# Altium project Reflow Oven.PrjPcb
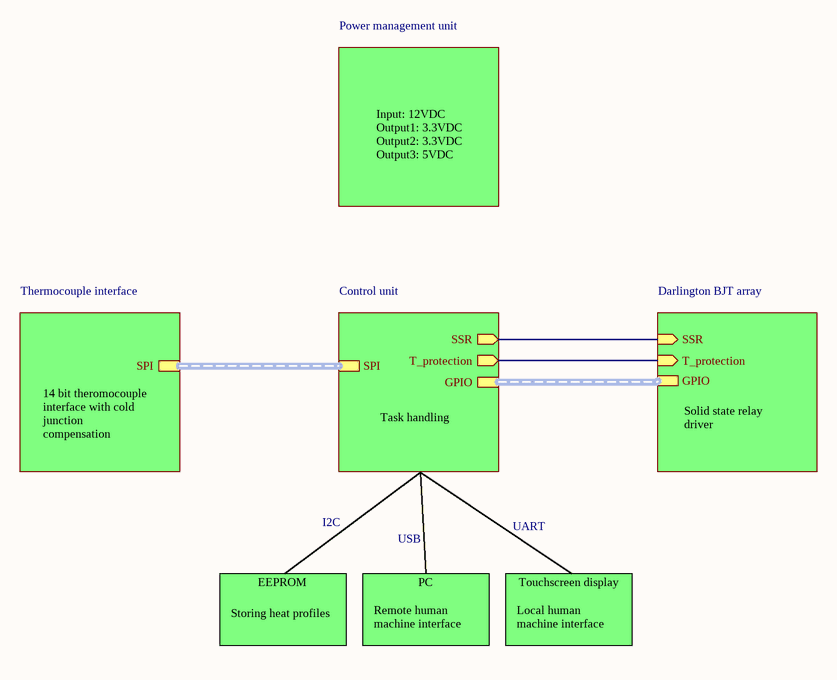
[diagram p0: Architecture.SchDoc]
GlobalProject: Reflow oven controller; GlobalDrwanBy: Tamás Polgár
5 sheets, 83 parts. Net scope: hierarchical (ports join the sheet entries above them; power ports are global).
Board file: PCBv1.PcbDoc
Sheets:
  Architecture.SchDoc
    Thermocouple interface = Thermocouple interface.SchDoc
    Control unit = ControlUnit.SchDoc
    Darlington BJT array = DarlingtonBJTArray.SchDoc
    Power management unit = Pwr management.SchDoc

## Sheet Architecture.SchDoc: Hardware architecture
size A4; CheckedBy: none; Organization: ORGANIZATION; Address1: ADDRESS 1; Address2: ADDRESS 2; Address3: ADDRESS 3; Address4: ADDRESS 4; Revision: -; SheetNumber: 1; SheetTotal: 5; ENG_APP_DATE: --/--/--; DSN_APP_DATE: --/--/--; CHK_APP_DATE: --/--/--

### Sub-sheets
Control unit = ControlUnit.SchDoc: SPI (harness SPI), SSR (out), T_protection (out), GPIO (harness GPIO)
Darlington BJT array = DarlingtonBJTArray.SchDoc: SSR (in), T_protection (in), GPIO (harness GPIO)
Power management unit = Pwr management.SchDoc: no entries
Thermocouple interface = Thermocouple interface.SchDoc: SPI (harness SPI)

### Nets
NetC36_1: sheet Control unit/T_protection, sheet Darlington BJT array/T_protection
NetIC30_4: sheet Control unit/SSR, sheet Darlington BJT array/SSR

### Buses and harness runs
harness sheet Control unit/GPIO = sheet Darlington BJT array/GPIO
harness sheet Control unit/SPI = sheet Thermocouple interface/SPI

### Notes on the sheet
- Input: 12VDC
  Output1: 3.3VDC
  Output2: 3.3VDC
  Output3: 5VDC
- 14 bit theromocouple interface with cold junction compensation
- Task handling
- Solid state relay driver
- I2C
- USB
- UART
- EEPROM
- Storing heat profiles
- PC
- Remote human machine interface
- Touchscreen display
- Local human machine interface
- Project:
- Title:
- Drawn by:
- Date and time:
- Checked by:
- Budapest University of Technology and Economics
- Faculty of Electrical Engineering and Informatics
- Sheet
- of
- Size:
- A4
- Revision:

## Sheet Thermocouple interface.SchDoc: Thermocouple interface
size A4; CheckedBy: none; Organization: ORGANIZATION; Address1: ADDRESS 1; Address2: ADDRESS 2; Address3: ADDRESS 3; Address4: ADDRESS 4; Revision: -; SheetNumber: 4; SheetTotal: 5; ENG_APP_DATE: --/--/--; DSN_APP_DATE: --/--/--; CHK_APP_DATE: --/--/--
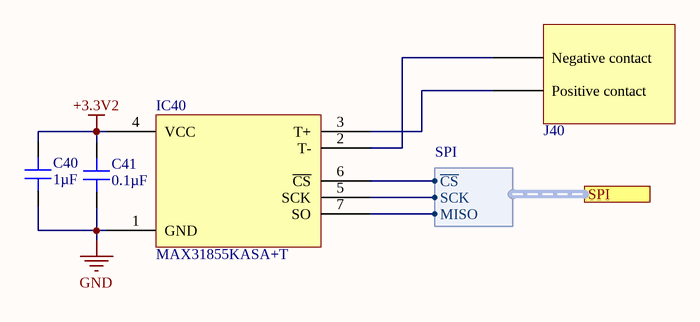
[diagram p1: Thermocouple interface.SchDoc]

### Parts
C40  1µF  [CAP 1206_3216 - 1.8MM]
C41  0.1µF  [CAP 1206_3216 - 1.8MM]
IC40  MAX31855KASA+T  [MAXIM SOIC-8 S8]
J40  IKM-K-PCB  [IM-K-PCB]  (value not drawn)

### Ports
SPI (harness SPI)

### Harnesses
SPI: ~{CS}, SCK, MISO

### Nets
+3.3V2: C40.2 C41.2 IC40.4(VCC)
GND: C40.1 C41.1 IC40.1(GND)
NetIC40_2: IC40.2(T-) J40.1(Negative_contact)
NetIC40_3: IC40.3(T+) J40.0(Positive_contact)
NetIC40_5: IC40.5(SCK) ; port SPI.SCK
NetIC40_6: IC40.6(~{CS}) ; port SPI.~{CS}
NetIC40_7: IC40.7(SO) ; port SPI.MISO

### Notes on the sheet
- Project:
- Title:
- Drawn by:
- Date and time:
- Checked by:
- Budapest University of Technology and Economics
- Faculty of Electrical Engineering and Informatics
- Sheet
- of
- Size:
- A4
- Revision:

### Library data of the parts
C40 = C1206F105M5RACAUTO: CAP CER 1UF 50V X7R 1206; Manufacturer: KEMET; Tolerance: ±20%; Part Number: C1206F105M5RACAUTO; Value: 1µF; Applications: Automotive; Capacitance: 1µF; ComponentLink1Description: Datasheet; ComponentLink1URL: https://api.kemet.com/component-edge/download/datasheet/C1206F105M5RACAUTO.pdf; ComponentLink2Description: DigiKey Link; ComponentLink2URL: http://digikey.com/product-detail/en/kemet/C1206F105M5RACAUTO/399-13313-1-ND/5879283; Device Package: 1206 (3216 Metric); Features: Open Mode; LastUpdated: 2020. 09. 02. 1:05:40; Lifecycle Status: Active; Minimum Order: 1; Mounting Type: Surface Mount, MLCC; Operating Temperature: -55°C ~ 125°C; Package / Case: 1206 (3216 Metric); Packaging: TapeAndReel; PartId: 19986; Part Status: Active; Price: 0.21; Ratings: AEC-Q200; Series: SMD Auto X7R FO; Size / Dimension: 0.126" L x 0.063" W (3.20mm x 1.60mm); Supplier 1: DigiKey; Supplier Part Number 1: 399-13313-1-ND; Temperature Coefficient: X7R; Thickness (Max): 0.071" (1.80mm); Voltage - Rated: 50V
C41 = C1206X104K5RECAUTO: CAP CER 0.1UF 50V X7R 1206; Manufacturer: KEMET; Tolerance: ±10%; Part Number: C1206X104K5RECAUTO; Value: 0.1µF; Applications: Automotive, Boardflex Sensitive, ESD Protection; Capacitance: 0.1µF; ComponentLink1Description: Datasheet; ComponentLink1URL: https://api.kemet.com/component-edge/download/datasheet/C1206X104K5RECAUTO.pdf; ComponentLink2Description: DigiKey Link; ComponentLink2URL: http://digikey.com/product-detail/en/kemet/C1206X104K5RECAUTO/399-17853-1-ND/8640520; Device Package: 1206 (3216 Metric); Features: Soft Termination; LastUpdated: 2020. 09. 02. 1:05:27; Lifecycle Status: Active; Minimum Order: 1; Mounting Type: Surface Mount, MLCC; Operating Temperature: -55°C ~ 125°C; Package / Case: 1206 (3216 Metric); Packaging: TapeAndReel; PartId: 22292; Part Status: Active; Price: 0.13; Ratings: AEC-Q200; Series: ESD SMD Auto X7R; Size / Dimension: 0.130" L x 0.063" W (3.30mm x 1.60mm); Supplier 1: DigiKey; Supplier Part Number 1: 399-17853-1-ND; Temperature Coefficient: X7R; Thickness (Max): 0.055" (1.40mm); Voltage - Rated: 50V
IC40 = MAX31855KASA+T: IC CONV THERMOCOUPLE-DGTL 8SOIC; Manufacturer: Maxim Integrated; Current - Supply: 900µA; Input Type: Thermocouple (Multiple); Output Type: Digital; Part Number: MAX31855KASA+T; ComponentLink1Description: Datasheet; ComponentLink1URL: https://datasheets.maximintegrated.com/en/ds/MAX31855.pdf; ComponentLink2Description: DigiKey Link; ComponentLink2URL: http://digikey.com/product-detail/en/maxim-integrated/MAX31855KASA-T/MAX31855KASA-TCT-ND/2708805; LastUpdated: 2020. 09. 02. 1:27:08; Lifecycle Status: Active; Minimum Order: 1; Mounting Type: Surface Mount; Operating Temperature: -40°C ~ 125°C; Package / Case: 8-SOIC (0.154", 3.90mm Width); Packaging: TapeAndReel; Part Status: Active; Price: 3.35; Series: -; Supplier 1: DigiKey; Supplier Part Number 1: MAX31855KASA+TCT-ND; Supplier Device Package: 8-SOIC; Type: Thermocouple to Digital Converter
J40 = IKM-K-PCB: Miniature Thermocouple PCB Mounting Socket; Manufacturer: Lab Facility; Supplier 1: Farnell; ComponentLink1Description: Datasheet; ComponentLink1URL: http://www.farnell.com/datasheets/2842097.pdf; ComponentLink2Description: 3D animaton; ComponentLink2URL: https://www.youtube.com/watch?v=aBtMT_bWiLk

## Sheet ControlUnit.SchDoc: Control Unit
size A4; CheckedBy: none; Organization: ORGANIZATION; Address1: ADDRESS 1; Address2: ADDRESS 2; Address3: ADDRESS 3; Address4: ADDRESS 4; Revision: -; SheetNumber: 5; SheetTotal: 5; ENG_APP_DATE: --/--/--; DSN_APP_DATE: --/--/--; CHK_APP_DATE: --/--/--
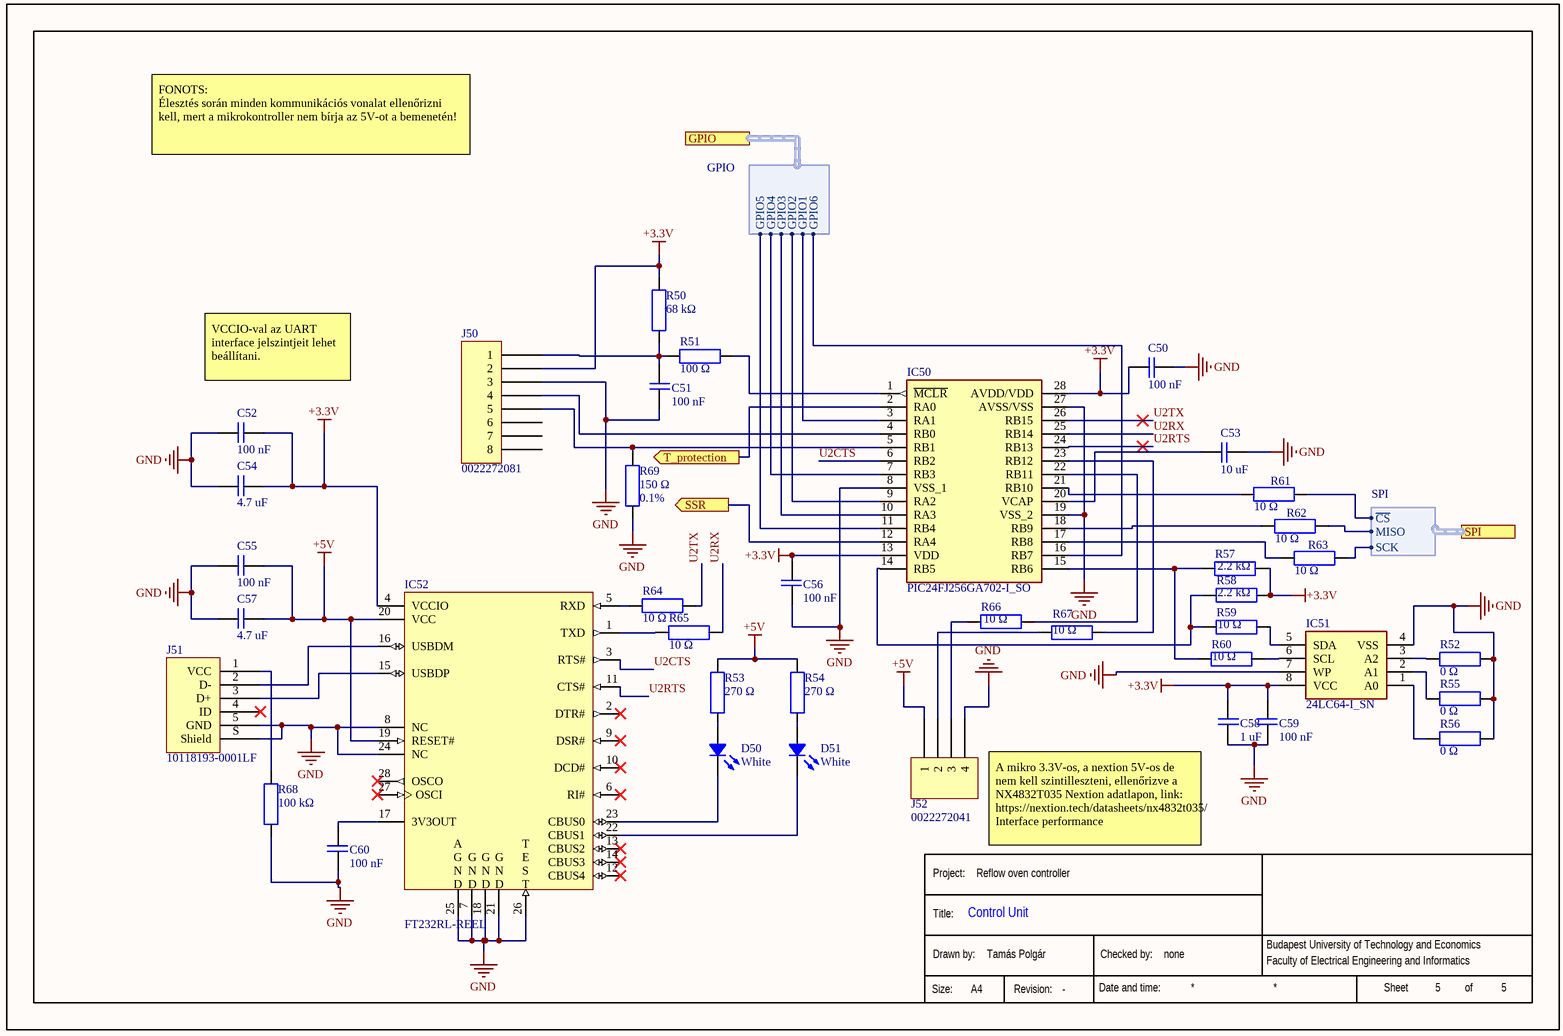
[diagram p2: ControlUnit.SchDoc]

### Parts
C50  100 nF  [1206 MLCC]
C51  100 nF  [1206 MLCC]
C52  100 nF  [1206 MLCC]
C53  10 uF  [1210 MLCC]
C54  4.7 uF  [1206 MLCC]
C55  100 nF  [1206 MLCC]
C56  100 nF  [1206 MLCC]
C57  4.7 uF  [1206 MLCC]
C58  1 uF  [1206 MLCC]
C59  100 nF  [1206 MLCC]
C60  100 nF  [1206 MLCC]
D50  White  [LED 1206_3216]
D51  White  [LED 1206_3216]
IC50  PIC24FJ256GA702-I_SO  [SOIC127P1030X265-28N]
IC51  24LC64-I_SN  [SOIC127P600X175-8N]
IC52  FT232RL-REEL  [FTDI-SSOP-28_N]
J50  0022272081  [MOLEX KK 0022272081]
J51  10118193-0001LF  [FCI USB 10118193-0001LF]
J52  0022272041  [MOLEX KK 0022272041]
R50  68 kΩ  [1206 RES]
R51  100 Ω  [1206 RES]
R52  0 Ω  [1206 RES]
R53  270 Ω  [1206 RES]
R54  270 Ω  [1206 RES]
R55  0 Ω  [1206 RES]
R56  0 Ω  [1206 RES]
R57  2.2 kΩ  [1206 RES]
R58  2.2 kΩ  [1206 RES]
R59  10 Ω  [1206 RES]
R60  10 Ω  [1206 RES]
R61  10 Ω  [1206 RES]
R62  10 Ω  [1206 RES]
R63  10 Ω  [1206 RES]
R64  10 Ω  [1206 RES]
R65  10 Ω  [1206 RES]
R66  10 Ω  [1206 RES]
R67  10 Ω  [1206 RES]
R68  100 kΩ  [0805 RES]
R69  150 Ω  Tpye: 0.1%  [1206 RES]

### Ports
GPIO (harness GPIO), SPI (harness SPI), SSR (out), T_protection (out)

### Harnesses
GPIO: GPIO6, GPIO1, GPIO2, GPIO3, GPIO4, GPIO5
SPI: ~{CS}, MISO, SCK

### Nets
+3.3V: C50.2 C52.2 C54.2 C56.2 C58.1 C59.2 IC50.13(VDD) IC50.28(AVDD/VDD) IC51.8(VCC) IC52.4(VCCIO) J50.2 R50.1 R57.1 R58.1
+5V: C55.2 C57.2 IC52.19(RESET#) IC52.20(VCC) J52.1 R53.1 R54.2
GND: C50.1 C51.2 C52.1 C53.1 C54.1 C55.1 C56.1 C57.1 C58.2 C59.1 C60.1 IC50.8(VSS_1) IC50.19(VSS_2) IC50.27(AVSS/VSS) IC51.4(VSS) IC51.7(WP) IC52.7(GND) IC52.8(NC) IC52.18(GND) IC52.21(GND) IC52.24(NC) IC52.25(AGND) IC52.26(TEST) J50.3 J51.5(GND) J51.S(Shield) J52.4 R52.1 R55.1 R56.1 R68.2 R69.2
U2CTS: IC50.6(RB2) IC52.3(RTS#)
U2RTS: IC50.24(RB13) IC52.11(CTS#)
U2RX: IC50.25(RB14) R65.1
U2TX: IC50.26(RB15) R64.1
NetC36_1: IC50.2(RA0) ; port T_protection
NetC51_1: C51.1 J50.1 R50.2 R51.2
NetC53_2: C53.2 IC50.20(VCAP)
NetC60_2: C60.2 IC52.17(3V3OUT)
NetD50_1: D50.1 R53.2
NetD50_2: D50.2 IC52.23(CBUS0)
NetD51_1: D51.1 R54.1
NetD51_2: D51.2 IC52.22(CBUS1)
NetIC30_4: IC50.12(RA4) ; port SSR
NetIC40_5: R63.1 ; port SPI.SCK
NetIC40_6: R61.1 ; port SPI.~{CS}
NetIC40_7: R62.1 ; port SPI.MISO
NetIC50_1: IC50.1(~{MCLR}) R51.1
NetIC50_3: IC50.3(RA1) ; port GPIO.GPIO1
NetIC50_4: IC50.4(RB0) J50.4
NetIC50_5: IC50.5(RB1) J50.5 R69.1
NetIC50_7: IC50.7(RB3) ; port GPIO.GPIO4
NetIC50_9: IC50.9(RA2) ; port GPIO.GPIO2
NetIC50_10: IC50.10(RA3) ; port GPIO.GPIO3
NetIC50_11: IC50.11(RB4) ; port GPIO.GPIO5
NetIC50_14: IC50.14(RB5) R58.2 R59.2
NetIC50_15: IC50.15(RB6) R57.2 R60.2
NetIC50_16: IC50.16(RB7) ; port GPIO.GPIO6
NetIC50_17: IC50.17(RB8) R63.2
NetIC50_18: IC50.18(RB9) R62.2
NetIC50_21: IC50.21(RB10) R61.2
NetIC50_22: IC50.22(RB11) R66.1
NetIC50_23: IC50.23(RB12) R67.1
NetIC51_1: IC51.1(A0) R56.2
NetIC51_2: IC51.2(A1) R55.2
NetIC51_3: IC51.3(A2) R52.2
NetIC51_5: IC51.5(SDA) R59.1
NetIC51_6: IC51.6(SCL) R60.1
NetIC52_1: IC52.1(TXD) R65.2
NetIC52_5: IC52.5(RXD) R64.2
NetIC52_15: IC52.15(USBDP) J51.3(D+)
NetIC52_16: IC52.16(USBDM) J51.2(D-)
NetJ51_1: J51.1(VCC) R68.1
NetJ52_2: J52.2 R67.2
NetJ52_3: J52.3 R66.2

Not connected (* = marked no-connect by the designer): IC52 2(DTR#)* 6(RI#)* 9(DSR#)* 10(DCD#)* 12(CBUS4)* 13(CBUS2)* 14(CBUS3)* 27(OSCI)* 28(OSCO)*; J50 6 7 8; J51 4(ID)*

### Notes on the sheet
- FONOTS:
  Élesztés során minden kommunikációs vonalat ellenőrizni kell, mert a mikrokontroller nem bírja az 5V-ot a bemenetén!
- (near C52) VCCIO-val az UART interface jelszintjeit lehet beállítani.
- (near C53) No driving source error disabled.
  MCU pin configured as an output.
- A mikro 3.3V-os, a nextion 5V-os de nem kell szintilleszteni, ellenőrizve a NX4832T035 Nextion adatlapon, link: https://nextion.tech/datasheets/nx4832t035/ Interface performance
- Project:
- Title:
- Drawn by:
- Date and time:
- Checked by:
- Budapest University of Technology and Economics
- Faculty of Electrical Engineering and Informatics
- Sheet
- of
- Size:
- A4
- Revision:
- (in symbol CMP-015-00000-1) A / G / N / D; G / N / D; T / E / S / T

### Library data of the parts
C50-C60 = Capacitor: Generic MLCC; Manufacturer article no.: *
  C50-C52 C55 C56 C59 C60: Value: 100 nF
  C53: Value: 10 uF
  C54 C57: Value: 4.7 uF
  C58: Value: 1 uF
D50 D51 = LTW-C230DS: LED WHITE 1206 SMD; Manufacturer: Lite-On Inc.; Configuration: Independent; Current - Test: 20mA; Lens Color: Yellow; Lens Size: 1.50mm x 1.60mm; Lens Style: Rectangle with Flat Top; Millicandela Rating: 315mcd; Viewing Angle: 130°; Voltage - Forward (Vf) (Typ): 3.2V; Part Number: LTW-C230DS; Color: White; ComponentLink1Description: Datasheet; ComponentLink1URL: http://optoelectronics.liteon.com/upload/download/DS22-2007-0232/LTW-C230DS.pdf; ComponentLink2Description: DigiKey Link; ComponentLink2URL: http://digikey.com/product-detail/en/lite-on-inc/LTW-C230DS/160-2221-1-ND/7597462; Device Package: 1206 (3216 Metric); Height (Max): 1.10mm; LastUpdated: 2020. 09. 02. 1:22:59; Lifecycle Status: Active; Minimum Order: 1; Mounting Type: Surface Mount; Package / Case: 1206 (3216 Metric); Packaging: TapeAndReel; PartId: 933; Part Status: Active; Price: 0.13; Series: -; Size / Dimension: 3.20mm L x 1.60mm W; Supplier 1: DigiKey; Supplier Part Number 1: 160-2221-1-ND; Supplier Device Package: 1206; Value: White
IC50 = PIC24FJ256GA702-I_SO: Integrated Circuit; Manufacturer_Name: Microchip; Manufacturer_Part_Number: PIC24FJ256GA702-I/SO; Datasheet Link: https://componentsearchengine.com/Datasheets/2/PIC24FJ256GA702-I_SO.pdf; Height: 2.65mm; Mouser Part Number: 579-24FJ256GA702ISO; Mouser Price/Stock: https://www.mouser.co.uk/ProductDetail/Microchip-Technology/PIC24FJ256GA702-I-SO/?qs=tOTLKpwhCJexnk7mtThrsA%3D%3D; Arrow Part Number: PIC24FJ256GA702-I/SO; Arrow Price/Stock: https://www.arrow.com/en/products/pic24fj256ga702-iso/microchip-technology
IC51 = 24LC64-I_SN: Integrated Circuit; Manufacturer_Name: Microchip; Manufacturer_Part_Number: 24LC64-I/SN; Datasheet Link: http://ww1.microchip.com/downloads/en/DeviceDoc/21189T.pdf; Height: 1.75mm; Mouser Part Number: 579-24LC64-I/SN; Mouser Price/Stock: https://www.mouser.co.uk/ProductDetail/Microchip-Technology/24LC64-I-SN?qs=L9Ynyw3fbhEAD4VyaxHPSg%3D%3D; Arrow Part Number: 24LC64-I/SN; Arrow Price/Stock: https://www.arrow.com/en/products/24lc64-isn/microchip-technology
IC52 = CMP-015-00000-1: USB UART IC, -0.5 to 6 V, 24 mA, -40 to 85 degC, 28-Pin SSOP, RoHS, Tape and Reel; Manufacturer: Future Technology Devices International (FTDI); Max Supply Voltage: 5.25V; Data Rate: 3Mbps; Nominal Supply Voltage: 5V; Min Supply Voltage: 3.3V; Channels: 1; Case/Package: SSOP; RoHS Compliant: True; Min Operating Temperature: -40°C; Manufacturer URL: http://www.ftdichip.com/; Pins: 16; Datasheet URL: http://datasheet.octopart.com/FT232RL-FTDI-datasheet-120501.pdf; Packaging: TapeandReel; Package Quantity: 2000; Datasheet Version: Rev. 1.04, 02/2006; Max Operating Temperature: 85°C; Interface: UART
J50 = 0022272081: CONN HEADER VERT 8POS 2.54MM; Manufacturer: Molex; Contact Length - Mating: 0.295" (7.49mm); Contact Length - Post: 0.140" (3.56mm); Material Flammability Rating: UL94 V-0; Number of Positions: 8; Number of Positions Loaded: All; Overall Contact Length: 0.560" (14.22mm); Pitch - Mating: 0.100" (2.54mm); Shrouding: Shrouded - 1 Wall; Style: Board to Cable/Wire; Part Number: 0022272081; ComponentLink1Description: Datasheet; ComponentLink1URL: https://www.molex.com/pdm_docs/sd/022272081_sd.pdf; ComponentLink2Description: DigiKey Link; ComponentLink2URL: http://digikey.com/product-detail/en/molex/0022272081/WM4117-ND/1130583; Connector Type: Header; Contact Finish - Mating: Tin; Contact Finish - Post: Tin; Contact Finish Thickness - Mating: 100.0µin (2.54µm); Contact Material: Brass; Contact Shape: Square; Contact Type: Male Pin; Fastening Type: Friction Lock; Insulation Color: Natural; Insulation Height: 0.461" (11.70mm); Insulation Material: Polyamide (PA), Nylon; LastUpdated: 2020. 01. 12. 23:52:41; Lifecycle Status: Active; Minimum Order: 1; Mounting Type: Through Hole; Number of Rows: 1; Packaging: Bulk; PartId: 82; Part Status: Active; Price: 0.60; Series: KK 6410; Supplier 1: DigiKey; Supplier Part Number 1: WM4117-ND; Termination: Solder
J51 = 10118193-0001LF: CONN RCPT USB2.0 MICRO B SMD R/A; Manufacturer: Amphenol ICC (FCI); Connector Type: USB - micro B; Current Rating (Amps): 1.8A per Contact; Gender: Receptacle; Mating Cycles: 10000; Number of Contacts: 5; Number of Ports: 1; Shielding: Shielded; Voltage - Rated: 100VAC; Part Number: 10118193-0001LF; ComponentLink1Description: Datasheet; ComponentLink1URL: https://cdn.amphenol-icc.com/media/wysiwyg/files/documentation/datasheet/inputoutput/io_usb_micro.pdf; ComponentLink2Description: DigiKey Link; ComponentLink2URL: //digikey.com/product-detail/en/amphenol-icc-fci/10118193-0001LF/609-4616-2-ND/2785388; Features: Solder Retention; LastUpdated: 2019. 12. 09. 20:51:28; Lifecycle Status: 0; Minimum Order: 1; Mounting Feature: Horizontal; Mounting Type: Surface Mount, Right Angle; Through Hole; Operating Temperature: -30°C ~ 80°C; Packaging: TapeAndReel; Part Status: Active; Price: 0.21; Series: -; Specifications: USB 2.0; Supplier 1: DigiKey; Supplier Part Number 1: 609-4616-2-ND; Termination: Solder
J52 = 0022272041: CONN HEADER VERT 4POS 2.54MM; Manufacturer: Molex; Contact Length - Mating: 0.295" (7.49mm); Contact Length - Post: 0.140" (3.56mm); Material Flammability Rating: UL94 V-0; Number of Positions: 4; Number of Positions Loaded: All; Overall Contact Length: 0.560" (14.22mm); Pitch - Mating: 0.100" (2.54mm); Shrouding: Shrouded - 1 Wall; Style: Board to Cable/Wire; Part Number: 0022272041; ComponentLink1Description: Datasheet; ComponentLink1URL: https://www.molex.com/pdm_docs/sd/022272041_sd.pdf; ComponentLink2Description: DigiKey Link; ComponentLink2URL: http://digikey.com/product-detail/en/molex/0022272041/WM4113-ND/1130579; Connector Type: Header; Contact Finish - Mating: Tin; Contact Finish - Post: Tin; Contact Finish Thickness - Mating: 100.0µin (2.54µm); Contact Material: Brass; Contact Shape: Square; Contact Type: Male Pin; Fastening Type: Friction Lock; Insulation Color: Natural; Insulation Height: 0.461" (11.70mm); Insulation Material: Polyamide (PA), Nylon; LastUpdated: 2020. 01. 12. 23:52:05; Lifecycle Status: Active; Minimum Order: 1; Mounting Type: Through Hole; Number of Rows: 1; Packaging: Bulk; PartId: 78; Part Status: Active; Price: 0.40; Series: KK 6410; Supplier 1: DigiKey; Supplier Part Number 1: WM4113-ND; Termination: Solder
R50-R68 = Resitor: Generic SMD resistor
  R50: Value: 68 kΩ
  R51: Value: 100 Ω
  R52 R55 R56: Value: 0 Ω
  R53 R54: Value: 270 Ω
  R57 R58: Value: 2.2 kΩ
  R59-R67: Value: 10 Ω
  R68: Value: 100 kΩ
R69 = Resitor: Precision SMD resistor; Value: 150 Ω

## Sheet DarlingtonBJTArray.SchDoc: Darlington BJR Array
size A4; CheckedBy: none; Organization: ORGANIZATION; Address1: ADDRESS 1; Address2: ADDRESS 2; Address3: ADDRESS 3; Address4: ADDRESS 4; Revision: -; SheetNumber: 3; SheetTotal: 5; ENG_APP_DATE: --/--/--; DSN_APP_DATE: --/--/--; CHK_APP_DATE: --/--/--
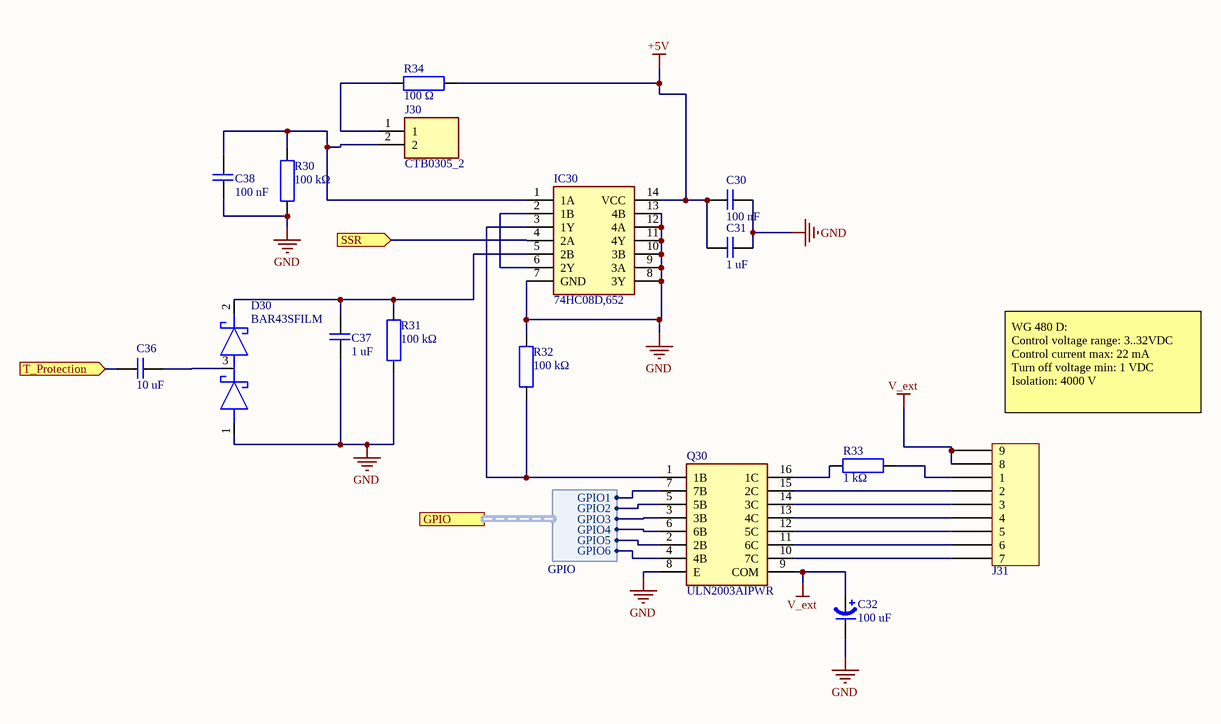
[diagram p3: DarlingtonBJTArray.SchDoc]

### Parts
C30  100 nF  [1206 MLCC]
C31  1 uF  [1206 MLCC]
C32  100 uF  [RADIAL 8x11]
C36  10 uF  [1210 MLCC]
C37  1 uF  [1206 MLCC]
C38  100 nF  [1206 MLCC]
D30  BAR43SFILM  [SOT105P242X150-3N]
IC30  74HC08D,652  [SOIC127P600X175-14N]
J30  CTB0305_2  [CTB03052]
J31  9P terminal block  [9P terminal block 3.50mm]  (value not drawn)
Q30  ULN2003AIPWR  [SOP65P640X120-16N]
R30  100 kΩ  [1206 RES]
R31  100 kΩ  [1206 RES]
R32  100 kΩ  [1206 RES]
R33  1 kΩ  [1206 RES]
R34  100 Ω  [1206 RES]

### Ports
GPIO (harness GPIO), SSR (in), T_Protection (in)

### Harnesses
GPIO: GPIO1, GPIO2, GPIO3, GPIO4, GPIO5, GPIO6

### Nets
+5V: C30.1 C31.1 IC30.14(VCC) R34.1
GND: C30.2 C31.2 C32.2 C37.1 C38.1 D30.1(A) IC30.7(GND) IC30.8(3Y) IC30.9(3A) IC30.10(3B) IC30.11(4Y) IC30.12(4A) IC30.13(4B) Q30.8(E) R30.2 R31.2 R32.1
V_ext: C32.1 J31.8 J31.9 Q30.9(COM)
NetC36_1: C36.1 ; port T_Protection
NetC36_2: C36.2 D30.3(A)
NetC37_2: C37.2 D30.2(K) IC30.5(2B) R31.1
NetC38_2: C38.2 IC30.1(1A) J30.2 R30.1
NetIC30_2: IC30.2(1B) IC30.6(2Y)
NetIC30_3: IC30.3(1Y) Q30.1(1B) R32.2
NetIC30_4: IC30.4(2A) ; port SSR
NetIC50_3: Q30.7(7B) ; port GPIO.GPIO1
NetIC50_7: Q30.6(6B) ; port GPIO.GPIO4
NetIC50_9: Q30.5(5B) ; port GPIO.GPIO2
NetIC50_10: Q30.3(3B) ; port GPIO.GPIO3
NetIC50_11: Q30.2(2B) ; port GPIO.GPIO5
NetIC50_16: Q30.4(4B) ; port GPIO.GPIO6
NetJ30_1: J30.1 R34.2
NetJ31_1: J31.1 R33.1
NetJ31_2: J31.2 Q30.15(2C)
NetJ31_3: J31.3 Q30.14(3C)
NetJ31_4: J31.4 Q30.13(4C)
NetJ31_5: J31.5 Q30.12(5C)
NetJ31_6: J31.6 Q30.11(6C)
NetJ31_7: J31.7 Q30.10(7C)
NetQ30_16: Q30.16(1C) R33.2

### Notes on the sheet
- (near J31) WG 480 D:
  Control voltage range: 3..32VDC
  Control current max: 22 mA
  Turn off voltage min: 1 VDC
  Isolation: 4000 V
- Project:
- Title:
- Drawn by:
- Date and time:
- Checked by:
- Budapest University of Technology and Economics
- Faculty of Electrical Engineering and Informatics
- Sheet
- of
- Size:
- A4
- Revision:

### Library data of the parts
C30 C31 C36-C38 = Capacitor: Generic MLCC; Manufacturer article no.: *
  C30 C38: Value: 100 nF
  C31 C37: Value: 1 uF
  C36: Value: 10 uF
C32 = Elco: Electrolytic capacitor; Value: 100 uF
D30 = BAR43SFILM: Dual 0.1A small signl schottky; Manufacturer_Name: STMicroelectronics; Datasheet Link: http://www.st.com/st-web-ui/static/active/en/resource/technical/document/datasheet/CD00000764.pdf; Height: 1.5mm; Manufacturer_Part_Number: BAR43SFILM; Mouser Part Number: 511-BAR43SFILM; Mouser Price/Stock: https://www.mouser.co.uk/ProductDetail/STMicroelectronics/BAR43SFILM?qs=QD4S45kuY2oNwRQsBwsPGQ%3D%3D; Arrow Part Number: BAR43SFILM; Arrow Price/Stock: https://www.arrow.com/en/products/bar43sfilm/stmicroelectronics
IC30 = 74HC08D,652: Integrated Circuit; Manufacturer_Name: Nexperia; Datasheet Link: http://www.nxp.com/documents/data_sheet/74HC_HCT08.pdf; Height: 1.75mm; Manufacturer_Part_Number: 74HC08D,652; Mouser Part Number: 771-HC08D652; Mouser Price/Stock: https://www.mouser.co.uk/ProductDetail/Nexperia/74HC08D652?qs=P62ublwmbi%2FiQ9gkrEoLJQ%3D%3D; Arrow Part Number: 74HC08D,652; Arrow Price/Stock: https://www.arrow.com/en/products/74hc08d652/nexperia
J30 = CTB0305_2: Connector; Manufacturer_Name: CamdenBoss Ltd; Manufacturer_Part_Number: CTB0305/2; Datasheet Link: http://www.farnell.com/datasheets/2866628.pdf; Height: 9.1mm; Arrow Part Number: CTB0305/2; Arrow Price/Stock: https://www.arrow.com/en/products/ctb03052/camdenboss-ltd
J31 = 9P terminal block: 3.50mm 9p terminal block
Q30 = ULN2003AIPWR: Transistor; Manufacturer_Name: Texas Instruments; Datasheet Link: http://www.ti.com/lit/gpn/uln2003ai; Height: 1.2mm; Manufacturer_Part_Number: ULN2003AIPWR; Mouser Part Number: 595-ULN2003AIPWR; Mouser Price/Stock: https://www.mouser.co.uk/ProductDetail/Texas-Instruments/ULN2003AIPWR?qs=pbofycSuseO3oIBRA1J7SQ%3D%3D; Arrow Part Number: ULN2003AIPWR; Arrow Price/Stock: https://www.arrow.com/en/products/uln2003aipwr/texas-instruments
R30-R34 = Resitor: Generic SMD resistor
  R30-R32: Value: 100 kΩ
  R33: Value: 1 kΩ
  R34: Value: 100 Ω

## Sheet Pwr management.SchDoc: Power management
size A4; CheckedBy: none; Organization: ORGANIZATION; Address1: ADDRESS 1; Address2: ADDRESS 2; Address3: ADDRESS 3; Address4: ADDRESS 4; Revision: -; SheetNumber: 2; SheetTotal: 5; ENG_APP_DATE: --/--/--; DSN_APP_DATE: --/--/--; CHK_APP_DATE: --/--/--
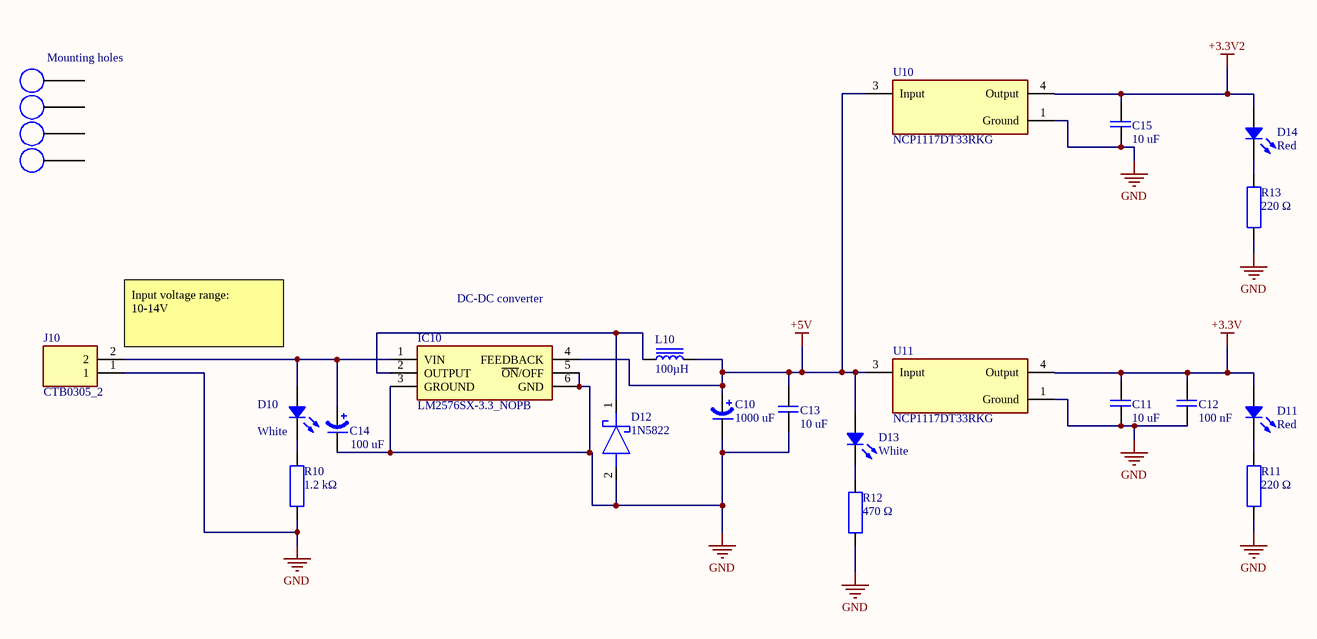
[diagram p4: Pwr management.SchDoc]

### Parts
C10  1000 uF  [Radial 13x20]
C11  10 uF  [1210 MLCC]
C12  100 nF  [1206 MLCC]
C13  10 uF  [1210 MLCC]
C14  100 uF  [RADIAL 8x11]
C15  10 uF  [1210 MLCC]
D10  White  [LED 1206_3216]
D11  Red  [LED 1206_3216]
D12  1N5822  [DIOAD2984W132L952D508]
D13  White  [LED 1206_3216]
D14  Red  [LED 1206_3216]
IC10  LM2576SX-3.3_NOPB  [KTT0005B]
J10  CTB0305_2  [CTB03052]
L10  100µH  [TDK SLF12575]
MH10  MH  [MH]  (value not drawn)  (no BOM)
MH11  MH  [MH]  (value not drawn)  (no BOM)
MH12  MH  [MH]  (value not drawn)  (no BOM)
MH13  MH  [MH]  (value not drawn)  (no BOM)
R10  1.2 kΩ  [1206 RES]
R11  220 Ω  [1206 RES]
R12  470 Ω  [1206 RES]
R13  220 Ω  [1206 RES]
U10  NCP1117DT33RKG  [FP-369C-MFG]
U11  NCP1117DT33RKG  [FP-369C-MFG]

### Nets
+3.3V: C11.2 C12.2 D11.1 U11.4(Output)
+3.3V2: C15.2 D14.1 U10.4(Output)
+5V: C10.1 C13.2 D13.1 IC10.4(FEEDBACK) L10.2 U10.3(Input) U11.3(Input)
GND: C10.2 C11.1 C12.1 C13.1 C14.2 C15.1 D12.2(A) IC10.3(GROUND) IC10.5(~{ON}/OFF) IC10.6(GND) J10.1 R10.2 R11.2 R12.2 R13.2 U10.1(Ground) U11.1(Ground)
NetC14_1: C14.1 D10.1 IC10.1(VIN) J10.2
NetD10_2: D10.2 R10.1
NetD11_2: D11.2 R11.1
NetD12_1: D12.1(K) IC10.2(OUTPUT) L10.1
NetD13_2: D13.2 R12.1
NetD14_2: D14.2 R13.1

Not connected (* = marked no-connect by the designer): MH10 1; MH11 1; MH12 1; MH13 1

### Notes on the sheet
- (near MH11) Mounting holes
- (near IC10) DC-DC converter
- (near J10) Input voltage range:
  10-14V
- Project:
- Title:
- Drawn by:
- Date and time:
- Checked by:
- Budapest University of Technology and Economics
- Faculty of Electrical Engineering and Informatics
- Sheet
- of
- Size:
- A4
- Revision:

### Library data of the parts
C10 C14 = Elco: Electrolytic capacitor
  C10: Value: 1000 uF
  C14: Value: 100 uF
C11-C13 C15 = Capacitor: Generic MLCC; Manufacturer article no.: *
  C11 C13 C15: Value: 10 uF
  C12: Value: 100 nF
D10 D11 D13 D14 = LTW-C230DS: as D50 on sheet ControlUnit; Part Number: LTW-C230DS; ComponentLink1Description: Datasheet; ComponentLink1URL: http://optoelectronics.liteon.com/upload/download/DS22-2007-0232/LTW-C230DS.pdf; ComponentLink2Description: DigiKey Link; ComponentLink2URL: http://digikey.com/product-detail/en/lite-on-inc/LTW-C230DS/160-2221-1-ND/7597462; Device Package: 1206 (3216 Metric); Height (Max): 1.10mm; LastUpdated: 2020. 09. 02. 1:22:59; Lifecycle Status: Active; Minimum Order: 1; Mounting Type: Surface Mount; Package / Case: 1206 (3216 Metric); Packaging: TapeAndReel; PartId: 933; Part Status: Active; Price: 0.13; Series: -; Size / Dimension: 3.20mm L x 1.60mm W; Supplier 1: DigiKey; Supplier Part Number 1: 160-2221-1-ND; Supplier Device Package: 1206
  D10 D13: Color: White; Value: White
  D11: Color: Red; Value: Red
  D14: Color: White; Value: Red
D12 = 1N5822: Schottky Diode; Manufacturer_Name: NEUTRAL; Datasheet Link: http://uk.rs-online.com/web/p/products/1124393; Manufacturer_Part_Number: 1N5822
IC10 = LM2576SX-3.3_NOPB: Integrated Circuit; Manufacturer_Name: Texas Instruments; Manufacturer_Part_Number: LM2576SX-3.3/NOPB; Datasheet Link: http://www.ti.com/lit/gpn/lm2576; Mouser Part Number: 926-LM2576SX33NOPB; Mouser Price/Stock: https://www.mouser.co.uk/ProductDetail/Texas-Instruments/LM2576SX-33-NOPB/?qs=X1J7HmVL2ZFzojdYFRsjwg%3D%3D; Arrow Part Number: LM2576SX-3.3/NOPB; Arrow Price/Stock: https://www.arrow.com/en/products/lm2576sx-3.3nopb/texas-instruments
J10 = CTB0305_2: as J30 on sheet DarlingtonBJTArray; Datasheet Link: http://www.farnell.com/datasheets/2866628.pdf; Height: 9.1mm; Arrow Part Number: CTB0305/2; Arrow Price/Stock: https://www.arrow.com/en/products/ctb03052/camdenboss-ltd
L10 = SLF12575T-101M1R9-PF: FIXED IND 100UH 1.9A 125 MOHM; Manufacturer: TDK Corporation; DC Resistance (DCR): 150mOhm Max; Inductance Frequency - Test: 1kHz; Material - Core: Ferrite; Shielding: Shielded; Tolerance: ±20%; Type: Wirewound; Part Number: SLF12575T-101M1R9-PF; ComponentLink1Description: Datasheet; ComponentLink1URL: https://product.tdk.com/info/en/catalog/datasheets/inductor_commercial_power_slf12575_en.pdf?ref_disty=digikey; ComponentLink2Description: DigiKey Link; ComponentLink2URL: http://digikey.com/product-detail/en/tdk-corporation/SLF12575T-101M1R9-PF/445-174409-1-ND/5880183; Current Rating (Amps): 1.9A; Current - Saturation: 1.9A; Device Package: Nonstandard; Height - Seated (Max): 0.309" (7.85mm); Inductance: 100µH; LastUpdated: 2020. 09. 02. 1:22:14; Lifecycle Status: Active; Minimum Order: 1; Mounting Type: Surface Mount; Operating Temperature: -40°C ~ 105°C; Package / Case: Nonstandard; Packaging: TapeAndReel; PartId: 124; Part Status: Active; Price: 0.94; Series: SLF; Size / Dimension: 0.492" L x 0.492" W (12.50mm x 12.50mm); Supplier 1: DigiKey; Supplier Part Number 1: 445-174409-1-ND; Value: 100µH
MH10-MH13 = MH: Mounting hole
R10-R13 = Resitor: Generic SMD resistor
  R10: Value: 1.2 kΩ
  R11 R13: Value: 220 Ω
  R12: Value: 470 Ω
U10 U11 = CMP-07128-000036-1: IC REG LINEAR 3.3V 1A DPAK-3; Accuracy: 1%; Input Bias Current: 6mA; Min Input Voltage: 10V; Reference Voltage: 1.27V; Dropout Voltage: 1.07V; Number of Regulators: 1; Output Type: Fixed; Quiescent Current: 10mA; Max Input Voltage: 20V; Polarity: Positive; Packaging: Tape and Reel; Number of Pins: 3; Min Current Limit: 1A; Max Output Current: 1A; REACH SVHC: No SVHC; Nominal Output Voltage: 3.3V; Case/Package: DPAK; Min Output Voltage: 3.3V; Length: 6.73mm; Output Voltage Accuracy: 1%; Radiation Hardening: No; Min Operating Temperature: 0°C; Halogen Free: Halogen Free; Width: 6.22mm; Output Voltage: 3.3V; Height: 2.38mm; Lead Free: Lead Free; Output Current: 1A; Package Quantity: 1; Contact Plating: Tin; Number of Outputs: 1; Max Operating Temperature: 125°C; Mount: Surface Mount; Current Rating: 1A

## Nets that join several sheets
+3.3V: ControlUnit (14 pins), Pwr management (C11.2 C12.2 D11.1 U11.4)
+3.3V2: Thermocouple interface (C40.2 C41.2 IC40.4), Pwr management (C15.2 D14.1 U10.4)
+5V: ControlUnit (7 pins), DarlingtonBJTArray (C30.1 C31.1 IC30.14 R34.1), Pwr management (7 pins)
GND: Thermocouple interface (C40.1 C41.1 IC40.1), ControlUnit (32 pins), DarlingtonBJTArray (17 pins), Pwr management (17 pins)
NetC36_1: ControlUnit (IC50.2), DarlingtonBJTArray (C36.1)
NetIC30_4: ControlUnit (IC50.12), DarlingtonBJTArray (IC30.4)
NetIC40_5: Thermocouple interface (IC40.5), ControlUnit (R63.1)
NetIC40_6: Thermocouple interface (IC40.6), ControlUnit (R61.1)
NetIC40_7: Thermocouple interface (IC40.7), ControlUnit (R62.1)
NetIC50_3: ControlUnit (IC50.3), DarlingtonBJTArray (Q30.7)
NetIC50_7: ControlUnit (IC50.7), DarlingtonBJTArray (Q30.6)
NetIC50_9: ControlUnit (IC50.9), DarlingtonBJTArray (Q30.5)
NetIC50_10: ControlUnit (IC50.10), DarlingtonBJTArray (Q30.3)
NetIC50_11: ControlUnit (IC50.11), DarlingtonBJTArray (Q30.2)
NetIC50_16: ControlUnit (IC50.16), DarlingtonBJTArray (Q30.4)